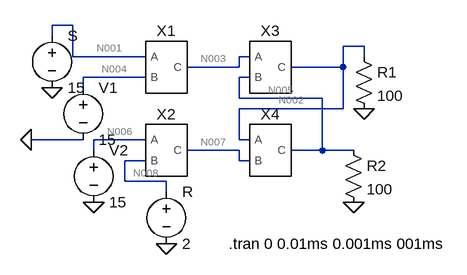
[diagram p0: schematic EXP-6-XP-1.asc]
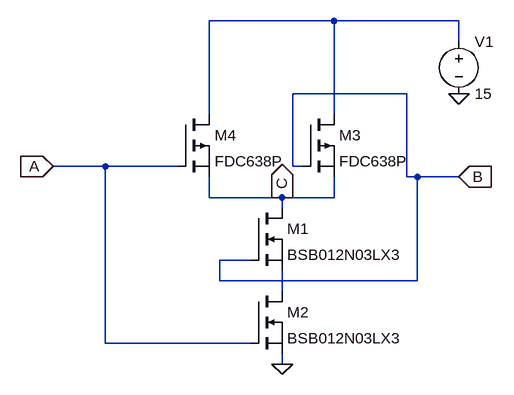
[diagram p1: sub-circuit exp6_1.asc]
EXP-6-XP-1.asc, the LTspice schematic file:
Version 4
SHEET 1 880 680
WIRE -48 16 -80 16
WIRE -80 32 -80 16
WIRE 400 48 368 48
WIRE -48 64 -48 16
WIRE 64 64 -48 64
WIRE 224 64 208 64
WIRE 400 64 400 48
WIRE 208 80 208 64
WIRE 208 80 128 80
WIRE 368 80 368 48
WIRE 368 80 288 80
WIRE 64 96 -32 96
WIRE 224 96 208 96
WIRE -32 112 -32 96
WIRE 208 128 208 96
WIRE 336 128 208 128
WIRE 368 144 368 80
WIRE 368 144 208 144
WIRE -32 192 -112 192
WIRE 64 192 -16 192
WIRE 208 192 208 144
WIRE 224 192 208 192
WIRE -16 208 -16 192
WIRE 208 208 128 208
WIRE 336 208 336 128
WIRE 336 208 288 208
WIRE 384 208 336 208
WIRE 64 224 32 224
WIRE 208 224 208 208
WIRE 224 224 208 224
WIRE 32 256 32 224
WIRE 96 256 32 256
WIRE 96 272 96 256
FLAG -80 112 0
FLAG -16 288 0
FLAG 96 352 0
FLAG -112 192 0
FLAG 400 144 0
FLAG 384 288 0
SYMBOL EXP6_1 96 80 R0
SYMATTR InstName X1
SYMBOL EXP6_1 96 208 R0
SYMATTR InstName X2
SYMBOL EXP6_1 256 80 R0
SYMATTR InstName X3
SYMBOL EXP6_1 256 208 R0
SYMATTR InstName X4
SYMBOL voltage -80 16 R0
SYMATTR InstName S
SYMATTR Value 15
SYMBOL voltage -32 96 R0
SYMATTR InstName V1
SYMATTR Value 15
SYMBOL voltage -16 192 R0
SYMATTR InstName V2
SYMATTR Value 15
SYMBOL voltage 96 256 R0
SYMATTR InstName R
SYMATTR Value 2
SYMBOL res 384 48 R0
SYMATTR InstName R1
SYMATTR Value 100
SYMBOL res 368 192 R0
SYMATTR InstName R2
SYMATTR Value 100
TEXT 192 352 Left 2 !.tran 0 0.01ms 0.001ms 001ms

exp6_1.asc, the sub-circuit schematic file:
Version 4
SHEET 1 880 680
WIRE 288 -240 96 -240
WIRE 480 -240 288 -240
WIRE 480 -208 480 -240
WIRE 400 -128 224 -128
WIRE 96 -96 96 -240
WIRE 288 -96 288 -240
WIRE -64 -16 -144 -16
WIRE 48 -16 -64 -16
WIRE 224 -16 224 -128
WIRE 240 -16 224 -16
WIRE 400 0 400 -128
WIRE 416 0 400 0
WIRE 480 0 416 0
WIRE 96 32 96 0
WIRE 208 32 96 32
WIRE 288 32 288 0
WIRE 288 32 208 32
WIRE 208 48 208 32
WIRE 160 128 112 128
WIRE 112 160 112 128
WIRE 416 160 416 0
WIRE 416 160 112 160
WIRE 208 176 208 144
WIRE -64 256 -64 -16
WIRE 160 256 -64 256
WIRE 208 288 208 272
FLAG 480 -128 0
FLAG 208 288 0
FLAG -144 -16 A
IOPIN -144 -16 In
FLAG 208 32 C
IOPIN 208 32 Out
FLAG 480 0 B
IOPIN 480 0 In
SYMBOL nmos 160 48 R0
SYMATTR InstName M1
SYMATTR Value BSB012N03LX3
SYMBOL nmos 160 176 R0
SYMATTR InstName M2
SYMATTR Value BSB012N03LX3
SYMBOL pmos 240 -96 R0
SYMATTR InstName M3
SYMATTR Value FDC638P
SYMBOL pmos 48 -96 R0
SYMATTR InstName M4
SYMATTR Value FDC638P
SYMBOL voltage 480 -224 R0
SYMATTR InstName V1
SYMATTR Value 15

The netlist it stands for:
* EXP-6-XP-1.asc
XX1 N001 N004 N003 exp6_1
XX2 N006 N008 N007 exp6_1
XX3 N003 N005 N002 exp6_1
XX4 N002 N007 N005 exp6_1
V§S N001 0 15
V1 N004 0 15
V2 N006 0 15
V§R N008 0 2
R1 N002 0 100
R2 N005 0 100

* block symbol definitions
.subckt exp6_1 A B C
M1 C B N002 N002 BSB012N03LX3
M2 N002 A 0 0 BSB012N03LX3
M3 N001 B C C FDC638P
M4 N001 A C C FDC638P
V1 N001 0 15
.ends exp6_1

.model NMOS NMOS
.model PMOS PMOS
.lib standard.mos
.tran 0 0.01ms 0.001ms 001ms
.backanno
.end

* Results of the author's LTspice run, read from the files saved beside the schematic
* Operating Point, zero values left out:
*   V(n003) = 2.023 V
*   V(n004) = 15 V
*   V(n001) = 15 V
*   V(n007) = 15 V
*   V(n008) = 2 V
*   V(n006) = 15 V
*   V(n002) = 15 V
*   V(n005) = 2.023 V
*   I(R2) = 20.23 mA
*   I(R1) = 150 mA
*   Ix(x1:C) = 35.24 pA
*   Ix(x2:C) = -16.37 pA
*   Ix(x3:C) = -150 mA
*   Ix(x4:C) = -20.23 mA